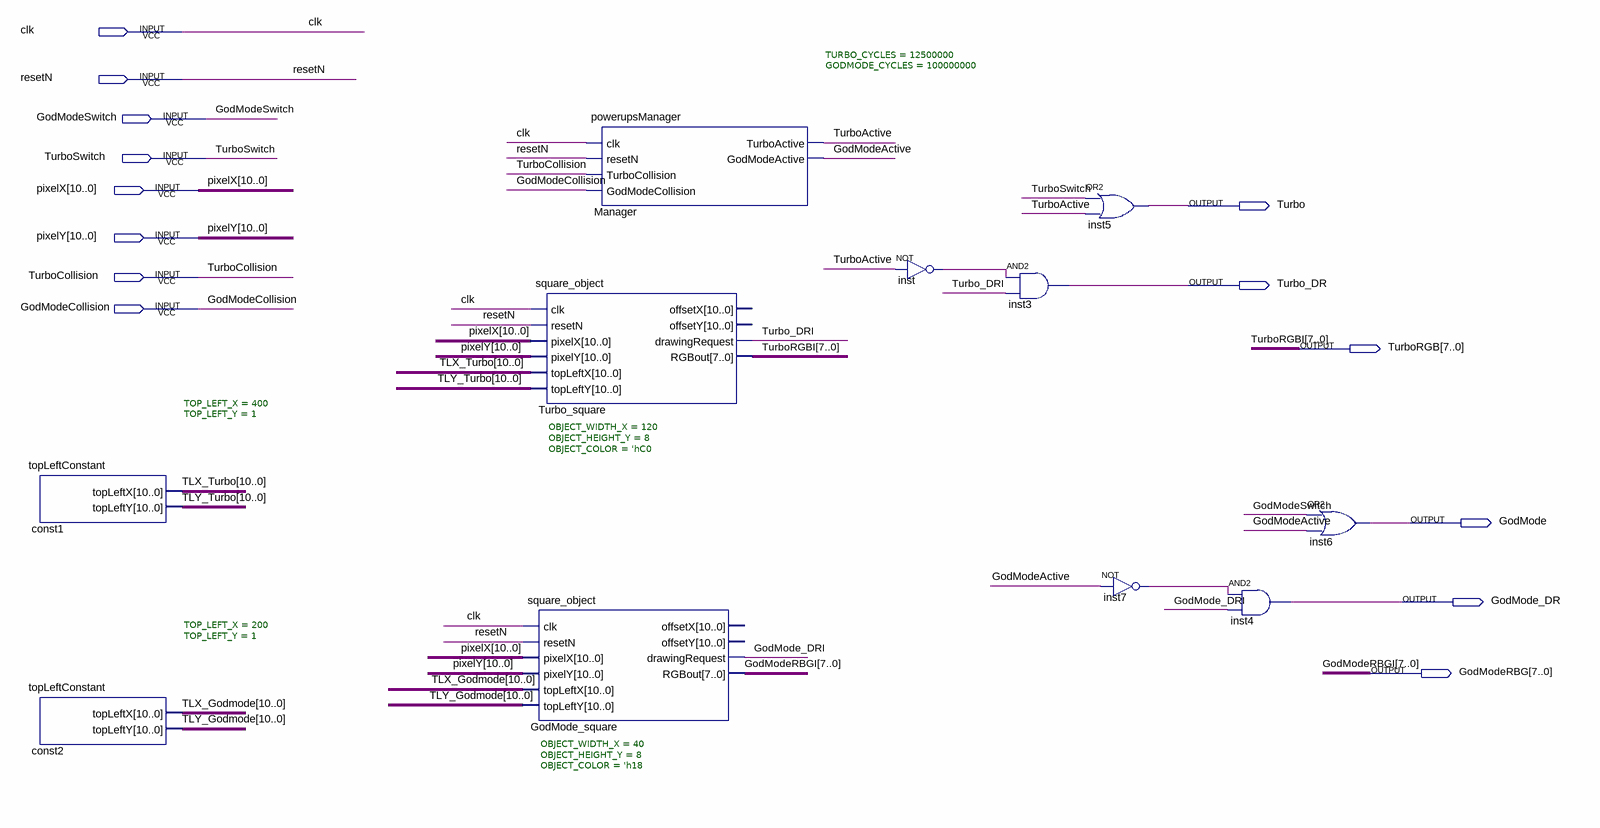
[diagram p0: schematic sheet]
// Quartus schematic powerUps.bdf as structural Verilog: 11 symbols, 14 pins
module powerUps (
  input  clk,
  input  resetN,
  input  GodModeSwitch,
  input  TurboSwitch,
  input  [10:0] pixelX,
  input  [10:0] pixelY,
  input  TurboCollision,
  input  GodModeCollision,
  output Turbo,
  output Turbo_DR,
  output [7:0] TurboRGB,
  output GodMode,
  output GodMode_DR,
  output [7:0] GodModeRBG
);

  wire GodMode_DRI, GodModeActive, inst7_out, inst_out, Turbo_DRI, TurboActive;
  wire [10:0] TLX_Godmode, TLX_Turbo, TLY_Godmode, TLY_Turbo;

  topLeftConstant #(.TOP_LEFT_X(400), .TOP_LEFT_Y(1)) const1 (.topLeftX(TLX_Turbo), .topLeftY(TLY_Turbo));
  topLeftConstant #(.TOP_LEFT_X(200), .TOP_LEFT_Y(1)) const2 (.topLeftX(TLX_Godmode), .topLeftY(TLY_Godmode));
  square_object #(.OBJECT_WIDTH_X(120), .OBJECT_HEIGHT_Y(8), .OBJECT_COLOR('hC0)) Turbo_square (
    .clk(clk), .resetN(resetN), .pixelX(pixelX), .pixelY(pixelY), .topLeftX(TLX_Turbo), .topLeftY(TLY_Turbo),
    .drawingRequest(Turbo_DRI), .RGBout(TurboRGB));  // open: offsetX, offsetY
  square_object #(.OBJECT_WIDTH_X(40), .OBJECT_HEIGHT_Y(8), .OBJECT_COLOR('h18)) GodMode_square (
    .clk(clk), .resetN(resetN), .pixelX(pixelX), .pixelY(pixelY), .topLeftX(TLX_Godmode),
    .topLeftY(TLY_Godmode), .drawingRequest(GodMode_DRI), .RGBout(GodModeRBG));  // open: offsetX, offsetY
  powerupsManager #(.TURBO_CYCLES(12500000), .GODMODE_CYCLES(100000000)) Manager (
    .clk(clk), .resetN(resetN), .TurboCollision(TurboCollision), .GodModeCollision(GodModeCollision),
    .TurboActive(TurboActive), .GodModeActive(GodModeActive));
  not inst (inst_out, TurboActive);
  and inst3 (Turbo_DR, inst_out, Turbo_DRI);
  or inst5 (Turbo, TurboSwitch, TurboActive);
  not inst7 (inst7_out, GodModeActive);
  and inst4 (GodMode_DR, inst7_out, GodMode_DRI);
  or inst6 (GodMode, GodModeSwitch, GodModeActive);

  // Other names for the same wires on the sheet: GodModeRBGI[7:0] = GodModeRBG; TurboRGBI[7:0] = TurboRGB
endmodule
